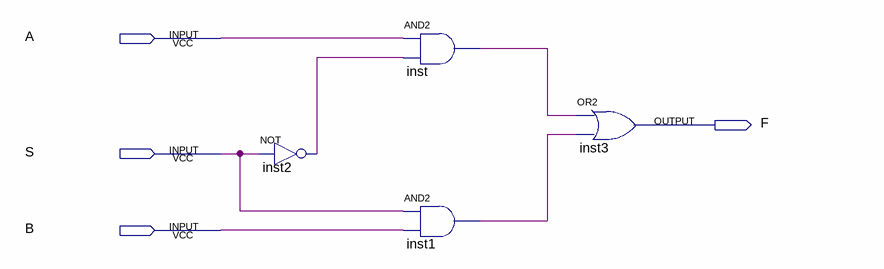
[diagram p0: schematic sheet]
// Quartus schematic multiplexer_2way_1bit.bdf as structural Verilog: 4 symbols, 4 pins
module multiplexer_2way_1bit (
  input  A,
  input  S,
  input  B,
  output F
);

  wire inst1_out, inst2_out, inst_out;

  not inst2 (inst2_out, S);
  and inst (inst_out, A, inst2_out);
  and inst1 (inst1_out, S, B);
  or inst3 (F, inst_out, inst1_out);
endmodule
